# EAGLE design pin matrix (EAGLE 6.5.0)
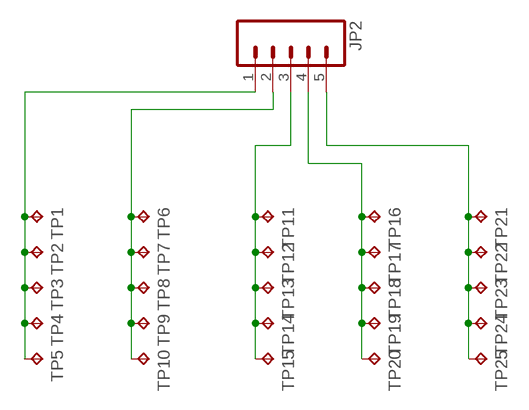
[diagram p0: schematic, sheet 1]

## Parts
JP2  M05PTH  [1X05]
TP1  TPPAD1-20  [P1-20]
TP2  TPPAD1-20  [P1-20]
TP3  TPPAD1-20  [P1-20]
TP4  TPPAD1-20  [P1-20]
TP5  TPPAD1-20  [P1-20]
TP6  TPPAD1-20  [P1-20]
TP7  TPPAD1-20  [P1-20]
TP8  TPPAD1-20  [P1-20]
TP9  TPPAD1-20  [P1-20]
TP10  TPPAD1-20  [P1-20]
TP11  TPPAD1-20  [P1-20]
TP12  TPPAD1-20  [P1-20]
TP13  TPPAD1-20  [P1-20]
TP14  TPPAD1-20  [P1-20]
TP15  TPPAD1-20  [P1-20]
TP16  TPPAD1-20  [P1-20]
TP17  TPPAD1-20  [P1-20]
TP18  TPPAD1-20  [P1-20]
TP19  TPPAD1-20  [P1-20]
TP20  TPPAD1-20  [P1-20]
TP21  TPPAD1-20  [P1-20]
TP22  TPPAD1-20  [P1-20]
TP23  TPPAD1-20  [P1-20]
TP24  TPPAD1-20  [P1-20]
TP25  TPPAD1-20  [P1-20]

## Nets
N$1: JP2.1 TP1.TP TP2.TP TP3.TP TP4.TP TP5.TP
N$2: JP2.2 TP6.TP TP7.TP TP8.TP TP9.TP TP10.TP
N$3: JP2.3 TP11.TP TP12.TP TP13.TP TP14.TP TP15.TP
N$5: JP2.5 TP21.TP TP22.TP TP23.TP TP24.TP TP25.TP
N$6: JP2.4 TP16.TP TP17.TP TP18.TP TP19.TP TP20.TP

## Library data of the parts
JP2 = SparkFun-Connectors:M05: Header 5 Standard 5-pin 0.1" header. Use with straight break away headers (SKU : PRT-00116), right angle break away headers (PRT-00553), swiss pins (PRT-00743), machine pins (PRT-00117), and female headers (PRT-00115). Molex polarized connector foot print use with SKU : PRT-08230 with associated crimp pins and housings.
TP1-TP25 = testpad:TP: Test pad

## Board
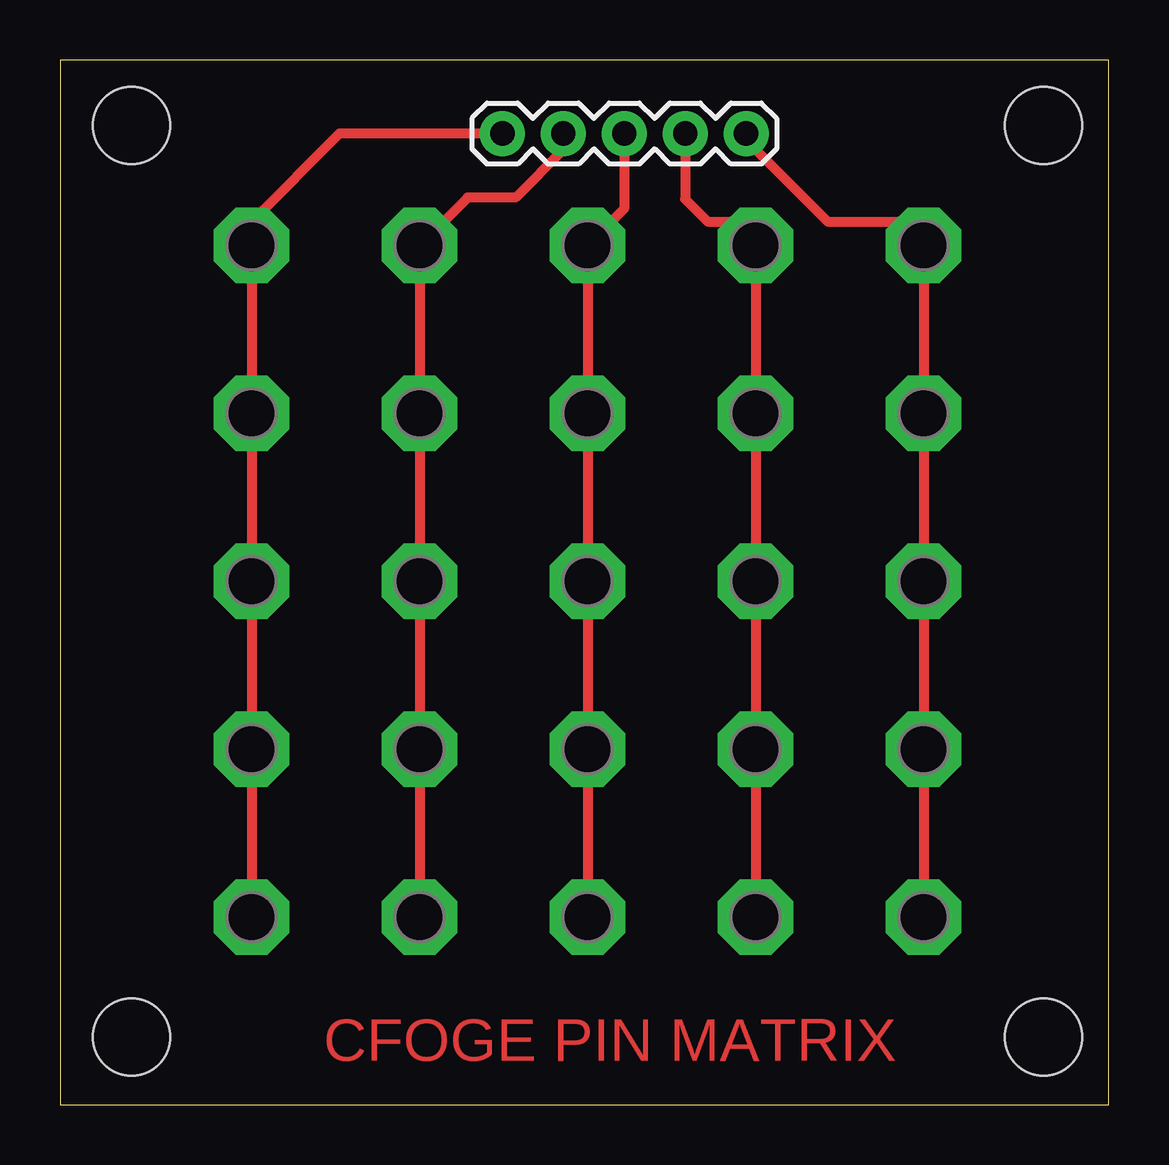
[diagram p1: board, top side]

Size 43.69 x 43.55 mm. Coordinates in mm from the lower left corner, seen from the top.
Outline: 0,0 43.69,0 43.69,43.55 0,43.55 0,0
Copper layers (1*16): Top 0.035mm / dielectric 1.5mm / Bottom 0.035mm
Design rules "default": minimum track width 10mil, minimum drill 24mil, track to track 8mil, track to pad 8mil, pad to pad 8mil, via to via 8mil, smd to smd 8mil, copper to edge 40mil, drill to drill 8mil, minimum pad ring 10mil, minimum via ring 8mil, stop-mask expansion 4mil, vias tented up to drill 0mil, thermal gap 10mil
Holes 3.2 mm at 2.98,2.82 40.98,2.82 40.98,40.82 2.98,40.82

### Footprints (pad centres in the part's own frame; a part is rotated, then mirrored left to right if it is on the bottom)
1X05 = drill 1.016 pad 1.88: 1 0,0; 2 2.54,0; 3 5.08,0; 4 7.62,0; 5 10.16,0
P1-20 = drill 2.007 pad 3.15 octagon: TP 0,0

### Placement (x,y rotation side)
JP2  18.43,40.48 0 top
TP1  7.98,35.82 0 top
TP2  7.98,28.82 0 top
TP3  7.98,21.82 0 top
TP4  7.98,14.82 0 top
TP5  7.98,7.82 0 top
TP6  14.98,35.82 0 top
TP7  14.98,28.82 0 top
TP8  14.98,21.82 0 top
TP9  14.98,14.82 0 top
TP10  14.98,7.82 0 top
TP11  21.98,35.82 0 top
TP12  21.98,28.82 0 top
TP13  21.98,21.82 0 top
TP14  21.98,14.82 0 top
TP15  21.98,7.82 0 top
TP16  28.98,35.82 0 top
TP17  28.98,28.82 0 top
TP18  28.98,21.82 0 top
TP19  28.98,14.82 0 top
TP20  28.98,7.82 0 top
TP21  35.98,35.82 0 top
TP22  35.98,28.82 0 top
TP23  35.98,21.82 0 top
TP24  35.98,14.82 0 top
TP25  35.98,7.82 0 top

### Tracks (layer width: path | path; a pad name or v marks a point on that pad's centre or on a via)
N$1
  Top 0.406: JP2.1 11.64,40.48 7.98,36.82 TP1.TP TP2.TP TP3.TP TP4.TP TP5.TP
N$2
  Top 0.406: JP2.2 20.97,39.81 18.98,37.82 16.98,37.82 TP6.TP TP7.TP TP8.TP | 14.98,20.82 TP8.TP | TP8.TP TP9.TP TP10.TP
N$3
  Top 0.406: JP2.3 23.51,37.35 TP11.TP TP12.TP TP13.TP TP14.TP TP15.TP
N$5
  Top 0.406: JP2.5 28.59,40.21 31.98,36.82 34.98,36.82 TP21.TP TP22.TP TP23.TP TP24.TP TP25.TP
N$6
  Top 0.406: JP2.4 26.05,37.75 26.98,36.82 27.98,36.82 TP16.TP TP17.TP TP18.TP TP19.TP TP20.TP

### Text on the board
Top: CFOGE PIN MATRIX